# Altium schematic sheet EnDat.SchDoc
size A; SheetNumber: 11; SheetTotal: 15
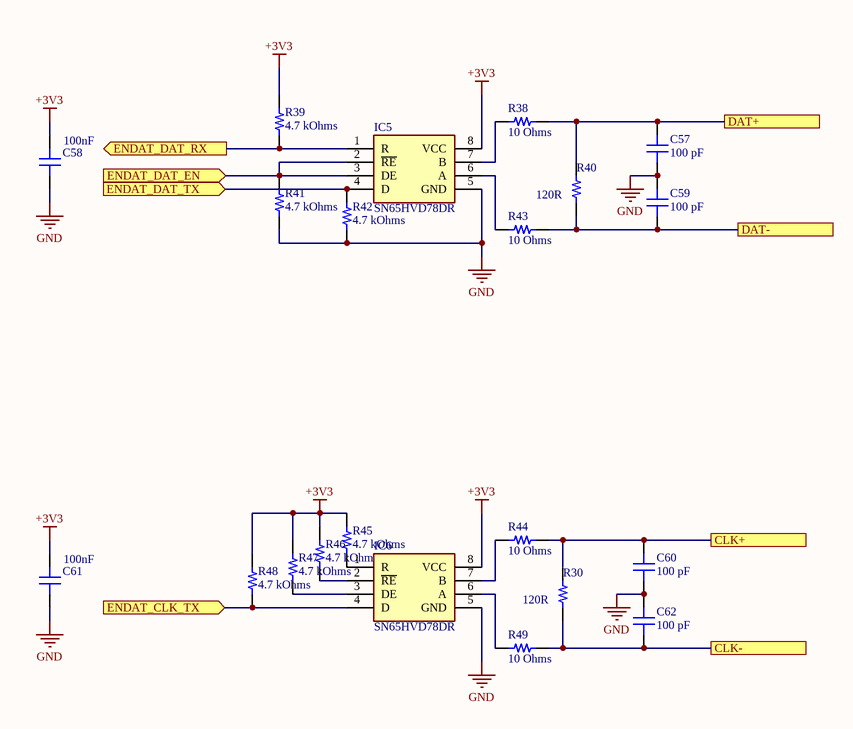
[diagram p0: EnDat.SchDoc]

## Parts
C57  100 pF  [CAP 0402_1005]
C58  100nF  [CAP 0402_1005]
C59  100 pF  [CAP 0402_1005]
C60  100 pF  [CAP 0402_1005]
C61  100nF  [CAP 0402_1005]
C62  100 pF  [CAP 0402_1005]
IC5  SN65HVD78DR  [SOIC127P600X175-8N]
IC6  SN65HVD78DR  [SOIC127P600X175-8N]
R30  120R  [RES 0603_1608]
R38  10 Ohms  [RES 0402_1005]
R39  4.7 kOhms  [RES 0402_1005]
R40  120R  [RES 0603_1608]
R41  4.7 kOhms  [RES 0402_1005]
R42  4.7 kOhms  [RES 0402_1005]
R43  10 Ohms  [RES 0402_1005]
R44  10 Ohms  [RES 0402_1005]
R45  4.7 kOhms  [RES 0402_1005]
R46  4.7 kOhms  [RES 0402_1005]
R47  4.7 kOhms  [RES 0402_1005]
R48  4.7 kOhms  [RES 0402_1005]
R49  10 Ohms  [RES 0402_1005]

## Ports
CLK+, CLK-, DAT+, DAT-, ENDAT_CLK_TX (in), ENDAT_DAT_EN (in), ENDAT_DAT_RX (out), ENDAT_DAT_TX (in)

## Nets
+3V3: C58.2 C61.2 IC5.8(VCC) IC6.8(VCC) R39.2 R45.2 R46.2 R47.2 R48.2
GND: C57.1 C58.1 C59.2 C60.1 C61.1 C62.2 IC5.5(GND) IC6.5(GND) R41.1 R42.1
CLK+: C60.2 R30.2 R44.2 ; port CLK+
CLK-: C62.1 R30.1 R49.2 ; port CLK-
DAT+: C57.2 R38.2 R40.2 ; port DAT+
DAT-: C59.1 R40.1 R43.2 ; port DAT-
ENDAT_CLK_TX: IC6.4(D) R48.1 ; port ENDAT_CLK_TX
ENDAT_DAT_EN: IC5.2(~{RE}) IC5.3(DE) R41.2 ; port ENDAT_DAT_EN
ENDAT_DAT_RX: IC5.1(R) R39.1 ; port ENDAT_DAT_RX
ENDAT_DAT_TX: IC5.4(D) R42.2 ; port ENDAT_DAT_TX
NetIC5_6: IC5.6(A) R43.1
NetIC5_7: IC5.7(B) R38.1
NetIC6_1: IC6.1(R) R45.1
NetIC6_2: IC6.2(~{RE}) R46.1
NetIC6_3: IC6.3(DE) R47.1
NetIC6_6: IC6.6(A) R49.1
NetIC6_7: IC6.7(B) R44.1

## Library data of the parts
C57 C59 C60 C62 = 500X07N101MV4T: CAP CER 100PF 50V C0G/NP0 0402; manufacturer: Johanson Dielectrics Inc.; Temperature Coefficient: C0G, NP0; Tolerance: ±20%; Part Number: 500X07N101MV4T; Capacitance: 100 pF; Applications: Bypass, Decoupling; componentlink1description: Datasheet; componentlink1url: https://www.johansondielectrics.com/downloads/x2y-filter-and-decoupling-capacitors.pdf; componentlink2description: DigiKey Link; componentlink2url: https://www.digikey.com/en/products/detail/johanson-dielectrics-inc/500X07N101MV4T/2046917; Device Package: 0402 (1005 Metric); Features: Low ESL (X2Y); lastupdated: 2/9/2024 8:04:38 PM; Lifecycle Status: Active; Minimum Order: 1; Mounting Type: Surface Mount, MLCC; Operating Temperature: -55°C ~ 125°C; Package / Case: 0402 (1005 Metric); packaging: TapeAndReel; partid: 1767; Part Status: Active; price: 0.08; series: X2Y®; Size / Dimension: 0.045" L x 0.025" W (1.14mm x 0.64mm); Supplier 1: DigiKey; Supplier Part Number 1: 709-1214-1-ND; Thickness (Max): 0.020" (0.51mm); value: 100 pF; Voltage - Rated: 50V
C58 C61 = CL05A105KO5NNNC: CAP CER 1UF 16V X5R 0402; Part Number: C29266; manufacturer: Samsung Electro-Mechanics; Capacitance: 10uF; Tolerance: ±10%; value: 1 µF; Applications: General Purpose; componentlink1description: Datasheet; componentlink1url: http://www.samsungsem.com/kr/support/product-search/mlcc/CL05A105KO5NNNC.jsp; componentlink2description: DigiKey Link; componentlink2url: https://www.digikey.com/en/products/detail/samsung-electro-mechanics/CL05A105KO5NNNC/3886725; Device Package: 0402 (1005 Metric); lastupdated: 2/9/2024 8:04:35 PM; Lifecycle Status: Active; Minimum Order: 1; Mounting Type: Surface Mount, MLCC; Operating Temperature: -55°C ~ 85°C; Package / Case: 0402 (1005 Metric); packaging: TapeAndReel; partid: 3120; Part Status: Active; price: 0.01; series: CL; Size / Dimension: 0.039" L x 0.020" W (1.00mm x 0.50mm); Supplier 1: DigiKey; Supplier Part Number 1: 1276-1067-1-ND; Temperature Coefficient: X5R; Thickness (Max): 0.022" (0.55mm); Voltage - Rated: 16V
IC5 IC6 = SN65HVD78DR: Integrated Circuit; Manufacturer_Name: Texas Instruments; Datasheet Link: http://www.ti.com/lit/gpn/sn65hvd78; Height: 1.75mm; Manufacturer_Part_Number: SN65HVD78DR; Mouser Part Number: 595-SN65HVD78DR; Mouser Price/Stock: https://www.mouser.co.uk/ProductDetail/Texas-Instruments/SN65HVD78DR?qs=GIZt7gVh5wSQImLM3RD5ag%3D%3D; Arrow Part Number: SN65HVD78DR; Arrow Price/Stock: https://www.arrow.com/en/products/sn65hvd78dr/texas-instruments?region=nac
R30 R40 = CR0603AFX-10R0EAS: RESA-AS 0603 10R 1% 100MW TC100; Manufacturer: Bourns Inc.; Value: 510R; Power (Watts): 0.1W, 1/10W; Resistance: 10 Ohms; Temperature Coefficient: ±100ppm/°C; Part Number: CR0603AFX-10R0EAS; ComponentLink1Description: Datasheet; ComponentLink1URL: //media.digikey.com/pdf/Data%20Sheets/Bourns%20PDFs/CRyyyyA-AS_Model_DS.pdf; ComponentLink2Description: DigiKey Link; ComponentLink2URL: https://www.digikey.com/en/products/detail/bourns-inc/CR0603AFX-10R0EAS/10240119; Composition: Thick Film; Device Package: 0603 (1608 Metric); Features: Anti-Sulfur, Automotive AEC-Q200, Moisture Resistant; Height - Seated (Max): 0.022" (0.55mm); LastUpdated: 2/9/2024 8:42:17 PM; Lifecycle Status: Active; Minimum Order: 1; Number of Terminations: 2; Operating Temperature: -55°C ~ 155°C; Package / Case: 0603 (1608 Metric); Packaging: TapeAndReel; PartId: 23787; Part Status: Active; Price: 0.01; Ratings: AEC-Q200; Series: CR0603A-AS; Size / Dimension: 0.063" L x 0.031" W (1.60mm x 0.80mm); Supplier 1: DigiKey; Supplier Part Number 1: CR0603AFX-10R0EASCT-ND; Supplier Device Package: 0603; Tolerance: ±1%
R38 R43 R44 R49 = WR04X100 JTL: RES 10 OHM 5% 1/16W 0402; Manufacturer: Walsin Technology Corporation; Power (Watts): 0.063W, 1/16W; Temperature Coefficient: -200/ +400ppm/°C; Part Number: WR04X100 JTL; Value: 10 Ohms; ComponentLink1Description: Datasheet; ComponentLink1URL: https://www.passivecomponent.com/wp-content/uploads/chipR/ASC_WR.pdf; ComponentLink2Description: DigiKey Link; ComponentLink2URL: https://www.digikey.com/en/products/detail/walsin-technology-corporation/WR04X100-JTL/13241174; Composition: Thick Film; Device Package: 0402 (1005 Metric); Height - Seated (Max): 0.016" (0.40mm); LastUpdated: 2/9/2024 8:28:55 PM; Lifecycle Status: Active; Minimum Order: 1; Number of Terminations: 2; Operating Temperature: -55°C ~ 155°C; Package / Case: 0402 (1005 Metric); Packaging: CutTape; PartId: 64776; Part Status: Active; Price: 0.01; Resistance: 10 Ohms; Series: WR; Size / Dimension: 0.039" L x 0.020" W (1.00mm x 0.50mm); Supplier 1: DigiKey; Supplier Part Number 1: 1292-WR04X100JTLCT-ND; Supplier Device Package: 0402; Tolerance: ±5%
R39 R41 R42 R45-R48 = WR04X4701FTL: RES 4.7K OHM 1% 1/16W 0402; Manufacturer: Walsin Technology Corporation; Power (Watts): 0.063W, 1/16W; Temperature Coefficient: ±100ppm/°C; Part Number: WR04X4701FTL; Value: 4.7 kOhms; ComponentLink1Description: Datasheet; ComponentLink1URL: https://www.passivecomponent.com/wp-content/uploads/chipR/ASC_WR.pdf; ComponentLink2Description: DigiKey Link; ComponentLink2URL: https://www.digikey.com/en/products/detail/walsin-technology-corporation/WR04X4701FTL/13239186; Composition: Thick Film; Device Package: 0402 (1005 Metric); Height - Seated (Max): 0.016" (0.40mm); LastUpdated: 2/9/2024 8:28:34 PM; Lifecycle Status: Active; Minimum Order: 1; Number of Terminations: 2; Operating Temperature: -55°C ~ 155°C; Package / Case: 0402 (1005 Metric); Packaging: CutTape; PartId: 77487; Part Status: Active; Price: 0.01; Resistance: 4.7 kOhms; Series: WR; Size / Dimension: 0.039" L x 0.020" W (1.00mm x 0.50mm); Supplier 1: DigiKey; Supplier Part Number 1: 1292-WR04X4701FTLCT-ND; Supplier Device Package: 0402; Tolerance: ±1%